# EAGLE design untitled (EAGLE 5.07)
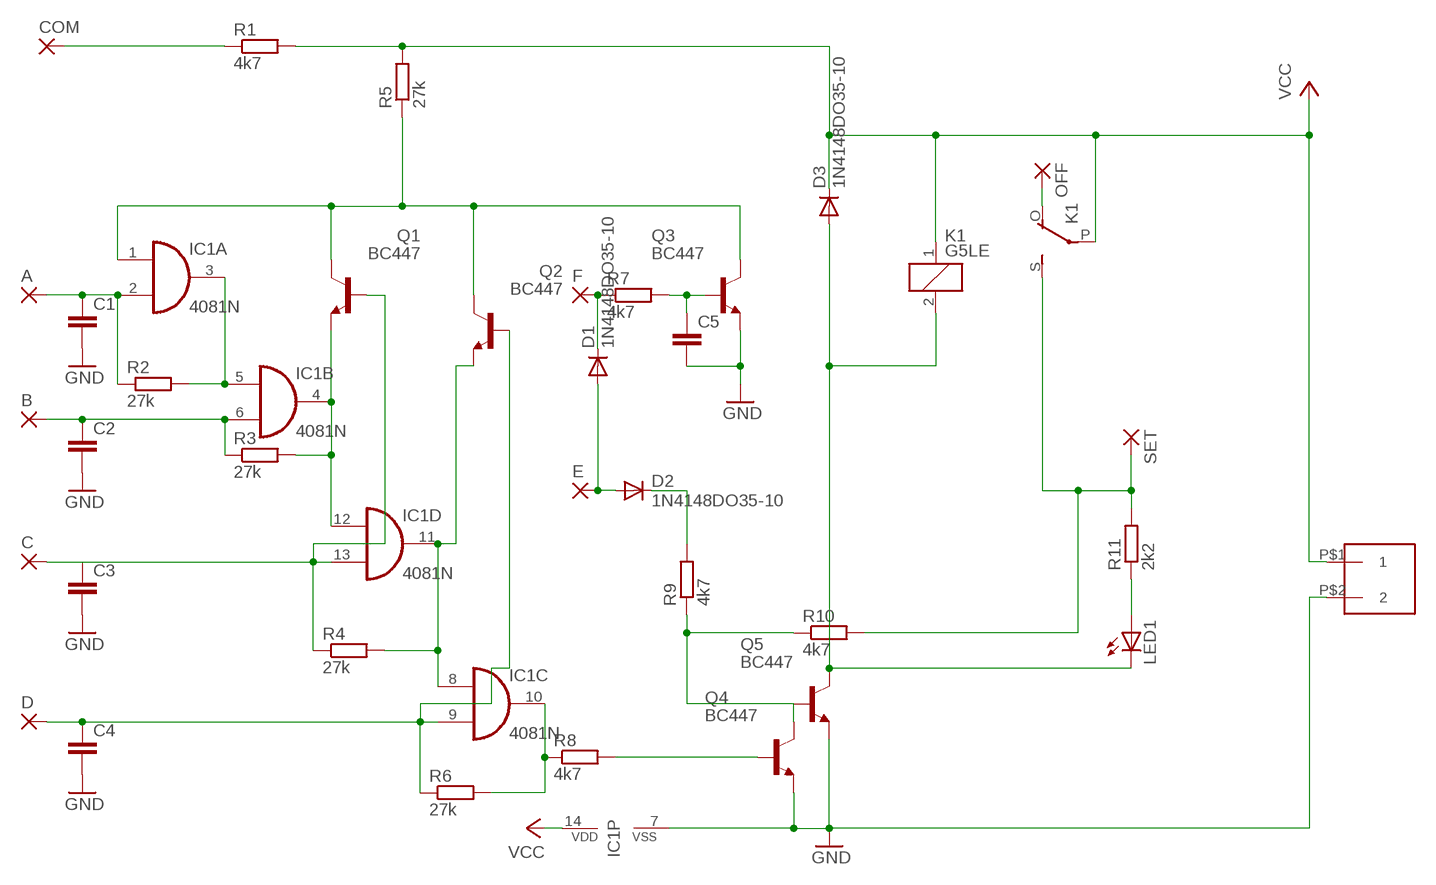
[diagram p0: schematic, sheet 1]

## Parts
A  2,15/1,0  [2,15/1,0]
B  2,15/1,0  [2,15/1,0]
BORNE_2_PCI2  BORNE_2_PCI  [BORNE_2_PCI]
C  2,15/1,0  [2,15/1,0]
C1  C-EU025-024X044  [C025-024X044]
C2  C-EU025-024X044  [C025-024X044]
C3  C-EU025-024X044  [C025-024X044]
C4  C-EU025-024X044  [C025-024X044]
C5  C-EU025-024X044  [C025-024X044]
COM  2,15/1,0  [2,15/1,0]
D  2,15/1,0  [2,15/1,0]
D1  1N4148DO35-10  [DO35-10]
D2  1N4148DO35-10  [DO35-10]
D3  1N4148DO35-10  [DO35-10]
E  2,15/1,0  [2,15/1,0]
F  2,15/1,0  [2,15/1,0]
IC1  4081N  [DIL14]
K1  G5LE  [G5LE]
LED1  LED5MM  [LED5MM]
OFF  2,15/1,0  [2,15/1,0]
Q1  BC447  [TO92-EBC]
Q2  BC447  [TO92-EBC]
Q3  BC447  [TO92-EBC]
Q4  BC447  [TO92-EBC]
Q5  BC447  [TO92-EBC]
R1  4k7  R-EU_0204/7  [0204/7]
R2  27k  R-EU_0204/7  [0204/7]
R3  27k  R-EU_0204/7  [0204/7]
R4  27k  R-EU_0204/7  [0204/7]
R5  27k  R-EU_0204/7  [0204/7]
R6  27k  R-EU_0204/7  [0204/7]
R7  4k7  R-EU_0204/7  [0204/7]
R8  4k7  R-EU_0204/7  [0204/7]
R9  4k7  R-EU_0204/7  [0204/7]
R10  4k7  R-EU_0204/7  [0204/7]
R11  2k2  R-EU_0204/7  [0204/7]
SET  2,15/1,0  [2,15/1,0]

## Nets
GND: BORNE_2_PCI2.P$2 C1.2 C2.2 C3.2 C4.2 C5.2 IC1.7(P:VSS) Q3.E Q4.E Q5.E
N$1: A.1(P) C1.1 IC1.2(A:I1) R2.1
N$2: B.1(P) C2.1 IC1.6(B:I1) R3.1
N$3: C4.1 D.1(P) IC1.9(C:I1) Q2.B R6.1
N$4: IC1.1(A:I0) Q1.C Q2.C Q3.C R5.1
N$5: IC1.3(A:O) IC1.5(B:I0) R2.2
N$6: IC1.4(B:O) IC1.12(D:I0) Q1.E R3.2
N$7: IC1.8(C:I0) IC1.11(D:O) Q2.E R4.2
N$8: IC1.10(C:O) R6.2 R8.1
N$9: Q4.B R8.2
N$10: D1.C F.1(P) R7.1
N$12: D1.A D2.A E.1(P)
N$13: D2.C R9.2
N$14: Q4.C Q5.B R9.1 R10.1
N$16: LED1.A R11.1
N$17: COM.1(P) R1.1
N$18: K1.S(2:S) R10.2 R11.2 SET.1(P)
N$19: D3.A K1.2 LED1.K(C) Q5.C
N$20: K1.O(2:O) OFF.1(P)
N$21: C5.1 Q3.B R7.2
N$22: C3.1 C.1(P) IC1.13(D:I1) Q1.B R4.1
VCC: BORNE_2_PCI2.P$1 D3.C IC1.14(P:VDD) K1.1 K1.P(2:P) R1.2 R5.2

## Library data of the parts
A B C COM D E F OFF SET = wirepad:2,15/1,0: THROUGH-HOLE PAD
BORNE_2_PCI2 = BORNE_2_PCI:BORNE_2_PCI
C1-C5 = rcl:C-EU: CAPACITOR, European symbol
D1-D3 = diode:1N4148: DIODE high speed (Philips)
IC1 = 40xx:4081: Quad 2-input AND
K1 = relay:G5LE: RELAY 1 x switch, 10 A/120 V AC, 8 A/30 V DC, Omron
LED1 = led:LED: LED OSRAM: - CHIPLED LG R971, LG N971, LY N971, LG Q971, LY Q971, LO R971, LY R971 LH N974, LH R974 LS Q976, LO Q976, LY Q976 LO Q996 - Hyper CHIPLED LW Q18S LB Q993, LB Q99A, LB R99A - SideLED LS A670, LO A670, LY A670, LG A670, LP A670 LB A673, LV A673, LT A673, LW A673 LH A674 LY A675 LS A676, LA A676, LO A676, LY A676, LW A676 LS A679, LY A679, LG A679 - Hyper Micro SIDELED® LS Y876, LA Y876, LO Y876, LY Y876 LT Y87S - SmartLED LW L88C, LW L88S LB L89C, LB L89S, LG L890 LS L89K, LO L89K, LY L89K LS L896, LA L896, LO L896, LY L896 - TOPLED LS T670, LO T670, LY T670, LG T670, LP T670 LSG T670, LSP T670, LSY T670, LOP T670, LYG T670 LG T671, LOG T671, LSG T671 LB T673, LV T673, LT T673, LW T673 LH T674 LS T676, LA T676, LO T676, LY T676, LB T676, LH T676, LSB T676, LW T676 LB T67C, LV T67C, LT T67C, LS T67K, LO T67K, LY T67K, LW E67C LS E67B, LA E67B, LO E67B, LY E67B, LB E67C, LV E67C, LT E67C LW T67C LS T679, LY T679, LG T679 LS T770, LO T770, LY T770, LG T770, LP T770 LB T773, LV T773, LT T773, LW T773 LH T774 LS E675, LA E675, LY E675, LS T675 LS T776, LA T776, LO T776, LY T776, LB T776 LHGB T686 LT T68C, LB T68C - Hyper Mini TOPLED® LB M676 - Mini TOPLED Santana® LG M470 LS M47K, LO M47K, LY M47K Source: http://www.osram.convergy.de LUXEON: - LUMILED® LXK2-PW12-R00, LXK2-PW12-S00, LXK2-PW14-U00, LXK2-PW14-V00 LXK2-PM12-R00, LXK2-PM12-S00, LXK2-PM14-U00 LXK2-PE12-Q00, LXK2-PE12-R00, LXK2-PE12-S00, LXK2-PE14-T00, LXK2-PE14-U00 LXK2-PB12-K00, LXK2-PB12-L00, LXK2-PB12-M00, LXK2-PB14-N00, LXK2-PB14-P00, LXK2-PB14-Q00 LXK2-PR12-L00, LXK2-PR12-M00, LXK2-PR14-Q00, LXK2-PR14-R00 LXK2-PD12-Q00, LXK2-PD12-R00, LXK2-PD12-S00 LXK2-PH12-R00, LXK2-PH12-S00 LXK2-PL12-P00, LXK2-PL12-Q00, LXK2-PL12-R00 Source: www.luxeon.com KINGBRIGHT: KA-3528ASYC Source: www.kingbright.com
Q1-Q5 = transistor-npn:BC447*: NPN Transistor
R1-R11 = rcl:R-EU_: RESISTOR, European symbol

## Board
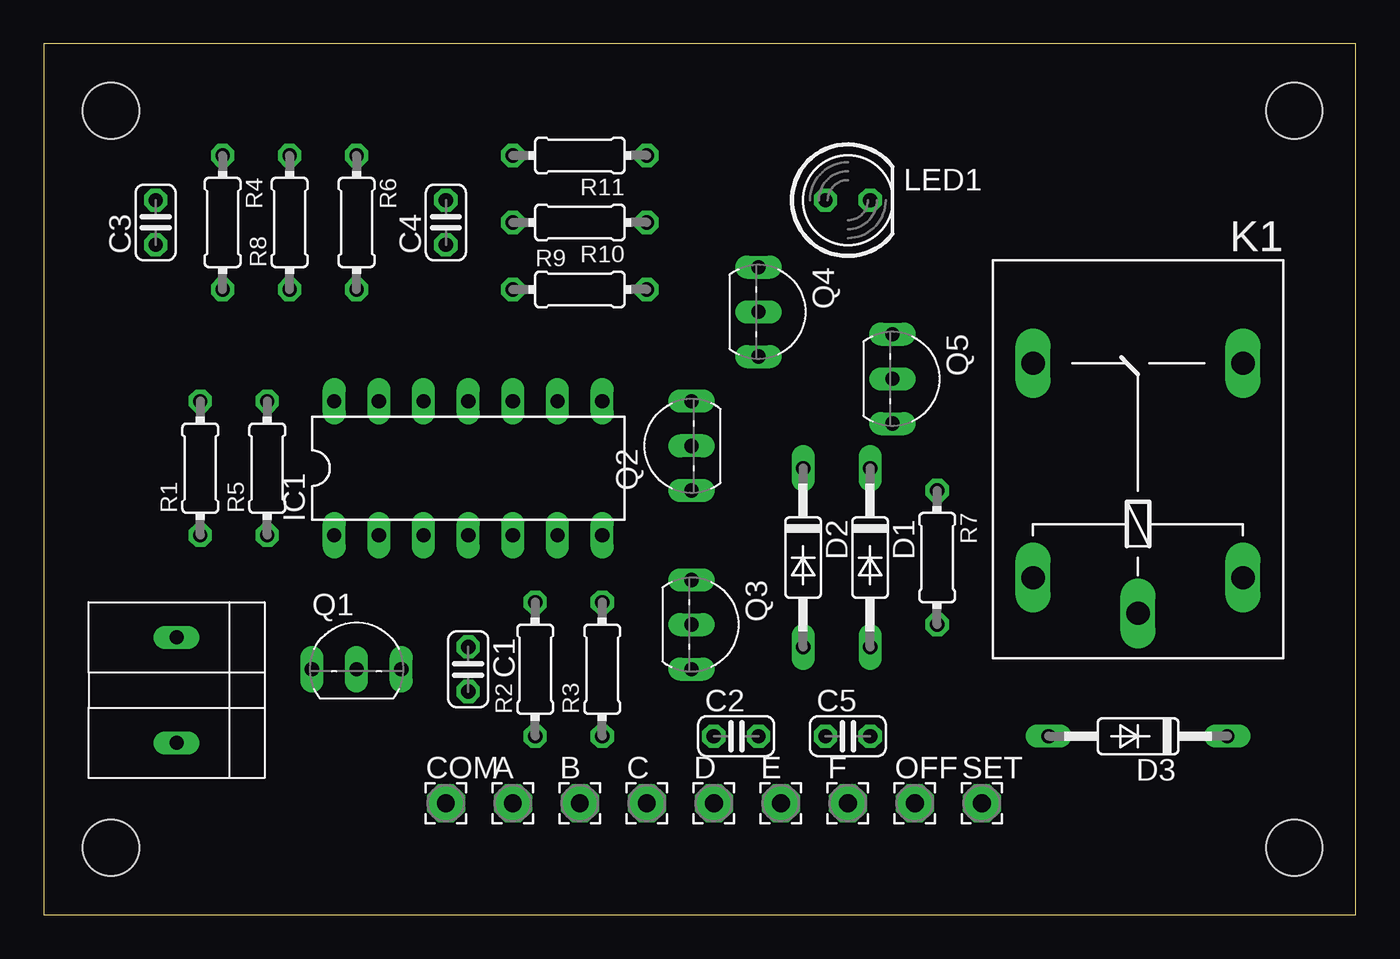
[diagram p1: board, top side]
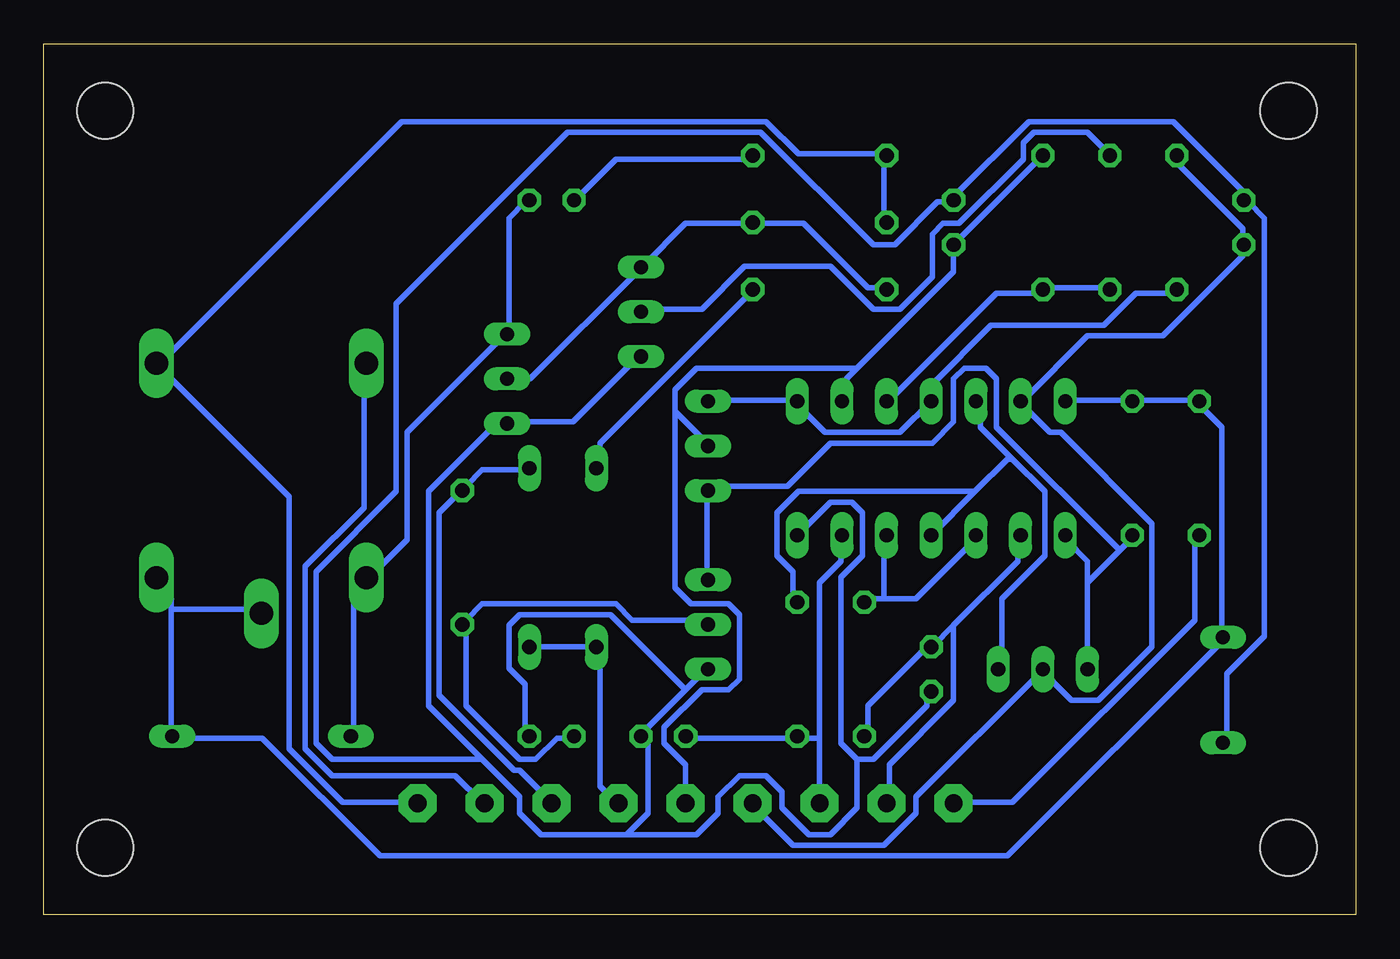
[diagram p2: board, bottom side, seen from below]

Size 74.6 x 49.52 mm. Coordinates in mm from the lower left corner, seen from the top.
Outline: 0,0 74.6,0 74.6,49.52 0,49.52 0,0
Copper layers (1*16): Top 0.035mm / dielectric 1.5mm / Bottom 0.035mm
Design rules "default *": minimum track width 12mil, minimum drill 24mil, track to track 12mil, track to pad 12mil, pad to pad 8mil, via to via 8mil, smd to smd 8mil, copper to edge 40mil, drill to drill 8mil, minimum pad ring 10mil, minimum via ring 8mil, stop-mask expansion 4mil, vias tented up to drill 0mil, thermal gap 10mil
Holes 3.2 mm at 3.81,3.81 3.81,45.72 71.12,45.72 71.12,3.81

### Footprints (pad centres in the part's own frame; a part is rotated, then mirrored left to right if it is on the bottom)
2,15/1,0 = drill 1.016 pad 2.159 octagon: 1 0,0
BORNE_2_PCI = drill 0.8 long: P$1 -3.08,-0.08; P$2 2.92,-0.08
C025-024X044 = drill 0.813 octagon: 1 -1.27,0; 2 1.27,0
DO35-10 = drill 0.813 long: A 5.08,0; C -5.08,0
DIL14 = drill 0.813 long: 1 -7.62,-3.81; 2 -5.08,-3.81; 3 -2.54,-3.81; 4 0,-3.81; 5 2.54,-3.81; 6 5.08,-3.81; 7 7.62,-3.81; 8 7.62,3.81; 9 5.08,3.81; 10 2.54,3.81; 11 0,3.81; 12 -2.54,3.81; 13 -5.08,3.81; 14 -7.62,3.81
G5LE = drill 1.321 long: 1 -7.493,-5.969; 2 -7.493,5.969; O 4.699,5.969; P -9.525,0; S 4.699,-5.969
LED5MM = drill 0.813 octagon: A -1.27,0; K 1.27,0
TO92-EBC = drill 0.813 long: B 0,-1.27; C -2.54,-1.27; E 2.54,-1.27
0204/7 = drill 0.813 octagon: 1 -3.81,0; 2 3.81,0

### Placement (x,y rotation side)
A  26.67,6.35 0 top
B  30.48,6.35 0 top
BORNE_2_PCI2  7.62,12.7 270 top
C  34.29,6.35 0 top
C1  24.13,13.97 270 top
C2  39.37,10.16 0 top
C3  6.35,39.37 90 top
C4  22.86,39.37 90 top
C5  45.72,10.16 0 top
COM  22.86,6.35 0 top
D  38.1,6.35 0 top
D1  46.99,20.32 270 top
D2  43.18,20.32 270 top
D3  62.23,10.16 180 top
E  41.91,6.35 0 top
F  45.72,6.35 0 top
IC1  24.13,25.4 0 top
K1  62.23,26.67 90 top
LED1  45.72,40.64 0 top
OFF  49.53,6.35 0 top
Q1  17.78,15.24 0 top
Q2  35.56,26.67 90 top
Q3  38.1,16.51 270 top
Q4  41.91,34.29 270 top
Q5  49.53,30.48 270 top
R1  8.89,25.4 90 top
R2  27.94,13.97 90 top
R3  31.75,13.97 90 top
R4  10.16,39.37 270 top
R5  12.7,25.4 90 top
R6  17.78,39.37 270 top
R7  50.8,20.32 270 top
R8  13.97,39.37 90 top
R9  30.48,35.56 0 top
R10  30.48,39.37 180 top
R11  30.48,43.18 180 top
SET  53.34,6.35 0 top

### Tracks (layer width: path | path; a pad name or v marks a point on that pad's centre or on a via)
GND
  Bottom 0.305: BORNE_2_PCI2.P$2 7.32,10.06 7.32,13.72 5.18,15.85 5.18,39.62 6.1,40.54 C3.2 6.1,40.84 10.36,45.11 18.59,45.11 22.86,40.84 C4.2 22.86,40.54 23.77,40.54 26.21,38.1 27.43,38.1 33.83,44.5 44.81,44.5 54.56,34.75 54.56,24.08 59.13,19.51 59.13,9.75 58.22,8.84 49.68,8.84 | 28.35,8.84 27.43,8.84 24.38,11.89 24.38,12.5 C1.2 | 28.35,8.84 29.26,9.75 29.26,19.2 28.04,20.42 28.04,22.86 28.65,23.47 29.87,23.47 IC1.7 | Q4.E 40.84,31.7 44.5,28.04 48.16,28.04 Q5.E 48.46,27.74 49.07,27.74 52.73,24.08 52.73,11.89 49.68,8.84 | 38.1,12.8 36.88,14.02 Q3.E | 40.23,10.67 38.1,12.8 | 40.23,10.67 40.54,10.36 C2.2 40.23,10.67 | 38.1,12.8 42.37,17.07 47.55,17.07 48.16,16.46 48.16,14.02 47.24,13.11 47.24,10.36 C5.2 | 49.68,8.84 47.55,6.71 47.55,5.79 46.33,4.57 41.45,4.57 | 41.45,4.57 40.23,5.79 40.23,10.67 | 28.35,8.84 28.35,6.1 29.87,4.57 31.09,4.57 32.61,6.1 32.61,7.01 33.53,7.92 35.05,7.92 36.27,6.71 36.27,5.79 37.49,4.57 41.45,4.57
N$1
  Bottom 0.305: R2.1 27.74,10.36 27.74,11.89 24.38,15.24 C1.1 24.08,15.24 22.86,16.46 | 22.86,16.46 19.2,20.12 19.2,21.34 IC1.2 | 22.86,16.46 22.86,12.19 26.52,8.53 26.52,6.4 A.1
N$2
  Bottom 0.305: C2.1 38.1,10.06 32,10.06 R3.1 31.7,10.06 30.48,10.06 | 30.48,10.06 30.48,18.9 29.26,20.12 29.26,21.34 IC1.6 | B.1 30.48,10.06
N$3
  Bottom 0.305: R6.1 C4.1 22.86,36.58 28.35,31.09 | 28.35,31.09 28.96,30.48 28.96,29.26 IC1.9 | 38.71,28.65 36.88,26.82 Q2.B | 38.71,28.65 38.71,29.87 37.49,31.09 28.35,31.09 | 38.71,28.65 38.71,18.59 37.8,17.68 35.66,17.68 35.05,17.07 35.05,13.41 35.66,12.8 37.19,12.8 39.32,10.67 39.32,9.75 38.1,8.53 D.1
N$4
  Bottom 0.305: Q3.C 36.88,19.2 36.88,24.08 Q2.C 36.58,24.38 32.31,24.38 29.87,26.82 24.08,26.82 22.86,28.04 22.86,30.48 22.25,31.09 21.03,31.09 20.42,30.48 20.42,27.74 13.41,20.73 | 15.24,18.9 15.24,20.12 16.46,21.34 IC1.1 | Q1.C 15.24,18.9 | 15.24,18.9 13.41,20.73 | 13.41,20.73 12.8,21.34 R5.1
N$5
  Bottom 0.305: 26.82,17.98 27.74,17.98 R2.2 | 26.82,17.98 24.99,17.98 21.64,21.34 IC1.3 | 26.82,17.98 26.82,21.34 IC1.5
N$6
  Bottom 0.305: 19.51,25.91 21.34,27.74 21.34,28.96 IC1.12 | 19.51,25.91 17.68,24.08 17.68,20.42 20.12,17.98 20.12,14.02 Q1.E | 21.64,24.08 19.81,25.91 19.51,25.91 | 21.64,24.08 IC1.4 | 21.64,24.08 31.7,24.08 32.92,22.86 32.92,20.42 32,19.51 32,17.98 R3.2
N$7
  Bottom 0.305: R4.2 10.36,35.36 12.5,35.36 14.33,33.53 20.73,33.53 24.08,30.18 24.08,29.26 IC1.11 25.91,27.43 30.18,27.43 31.7,28.96 IC1.8 32,29.26 36.58,29.26 Q2.E
N$8
  Bottom 0.305: R8.1 14.02,35.66 17.68,35.66 R6.2 17.98,35.36 20.42,35.36 26.52,29.26 IC1.10
N$9
  Bottom 0.305: Q4.B 40.54,34.44 37.19,34.44 34.75,36.88 29.87,36.88 27.43,34.44 25.91,34.44 24.08,36.27 24.08,38.71 23.47,39.32 22.55,39.32 18.9,42.98 18.9,43.89 18.29,44.5 15.24,44.5 14.02,43.28 R8.2
N$10
  Bottom 0.305: D1.C 47.24,25.3 49.68,25.3 50.6,24.38 R7.1 50.9,24.08 52.12,22.86 52.12,12.5 47.85,8.23 47.55,8.23 45.72,6.4 F.1
N$12
  Bottom 0.305: D1.A D2.A 42.98,15.24 42.98,7.32 42.06,6.4 E.1
N$13
  Bottom 0.305: D2.C 42.98,25.6 42.98,26.82 34.44,35.36 R9.2
N$14
  Bottom 0.305: R9.1 26.82,35.66 27.74,35.66 31.39,39.32 34.14,39.32 R10.1 34.44,39.32 38.1,39.32 40.54,36.88 Q4.C 40.84,36.58 46.94,30.48 Q5.B
N$16
  Bottom 0.305: R11.1 34.44,42.98 42.06,42.98 44.2,40.84 LED1.A
N$17
  Bottom 0.305: R1.1 9.14,21.34 9.14,16.76 19.51,6.4 22.86,6.4 COM.1
N$18
  Bottom 0.305: R10.2 26.82,39.62 26.82,42.98 R11.2 26.82,43.28 31.7,43.28 33.53,45.11 54.25,45.11 67.97,31.39 K1.S 67.97,31.09 60.66,23.77 60.66,9.45 57.61,6.4 53.34,6.4 SET.1
N$19
  Bottom 0.305: LED1.K 47.24,40.54 48.16,39.62 48.16,33.22 Q5.C 48.46,32.92 53.95,27.43 53.95,21.34 56.08,19.2 K1.2 56.39,18.9 57,18.29 57,10.36 D3.A
N$20
  Bottom 0.305: K1.O 56.39,31.09 56.39,23.16 59.74,19.81 59.74,9.45 58.22,7.92 51.21,7.92 49.68,6.4 OFF.1
N$21
  Bottom 0.305: Q3.B 36.88,16.76 41.15,16.76 42.06,17.68 49.68,17.68 50.6,16.76 R7.2 50.6,16.46 50.6,11.89 47.55,8.84 46.63,8.84 45.41,10.06 44.5,10.06 C5.1
N$22
  Bottom 0.305: C.1 34.14,6.1 32,3.96 26.82,3.96 24.99,5.79 24.99,6.71 17.98,13.72 Q1.B 17.68,13.72 16.15,12.19 14.63,12.19 11.58,15.24 11.58,22.25 16.76,27.43 17.37,27.43 18.9,28.96 IC1.13 18.9,29.26 15.24,32.92 10.97,32.92 6.4,37.49 6.4,38.1 | 6.4,38.1 6.4,39.01 10.36,42.98 R4.1 | 6.4,38.1 C3.1
VCC
  Bottom 0.305: 67.36,17.37 67.36,18.29 67.97,18.9 K1.1 | 67.36,17.37 67.36,10.36 D3.C 67.06,10.06 62.18,10.06 55.47,3.35 19.81,3.35 7.62,15.54 BORNE_2_PCI2.P$1 7.62,15.85 7.62,27.74 8.84,28.96 R1.2 9.14,29.26 12.5,29.26 R5.2 12.8,29.26 16.46,29.26 IC1.14 | 67.36,17.37 62.48,17.37 K1.P